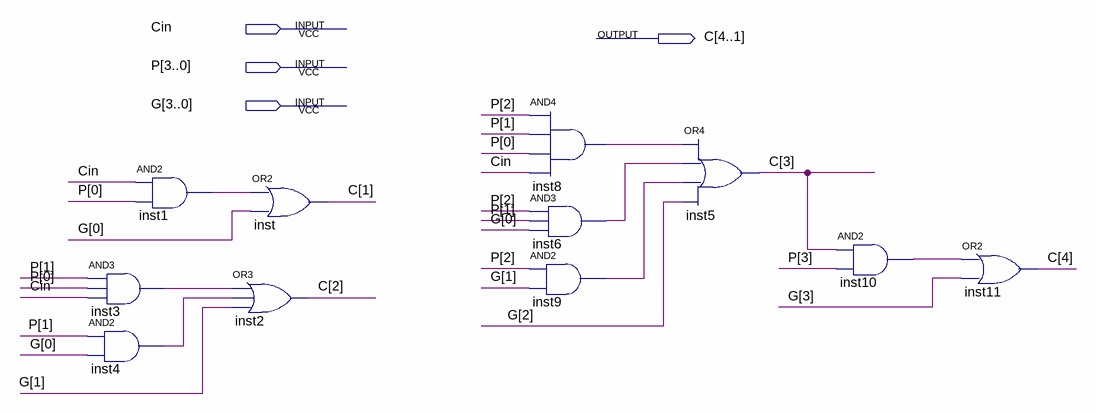
[diagram p0: schematic sheet]
// Quartus schematic CLA4.bdf as structural Verilog: 11 symbols, 4 pins
module CLA4 (
  input  Cin,
  input  [3:0] P,
  input  [3:0] G,
  output [4:1] C
);

  wire inst1_out, inst3_out, inst4_out, inst6_out, inst8_out, inst9_out, inst10_out;

  and inst1 (inst1_out, Cin, P[0]);
  and inst3 (inst3_out, P[1], P[0], Cin);
  and inst4 (inst4_out, P[1], G[0]);
  or inst (C[1], inst1_out, G[0]);
  or inst2 (C[2], inst3_out, inst4_out, G[1]);
  and inst8 (inst8_out, P[2], P[1], P[0], Cin);
  and inst6 (inst6_out, P[2], P[1], G[0]);
  and inst9 (inst9_out, P[2], G[1]);
  or inst5 (C[3], inst8_out, inst6_out, inst9_out, G[2]);
  and inst10 (inst10_out, C[3], P[3]);
  or inst11 (C[4], inst10_out, G[3]);
endmodule
